# Altium schematic sheet mux-optical.SchDoc: MUX-OPTICAL
size A4; DrawnBy: Dylan Vogel; Organization: UTAT SS; DocumentNumber: 6; Revision: 1; SheetNumber: 6; SheetTotal: 7
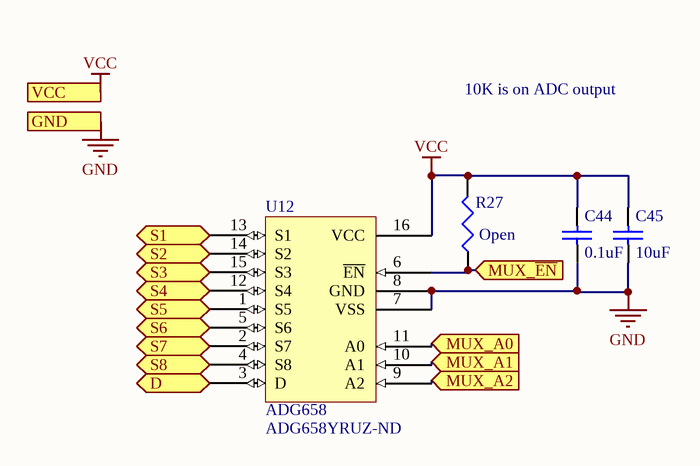
[diagram p0: mux-optical.SchDoc]

## Parts
C44  0.1uF  [0402]
C45  10uF  [1608[0603]]
R27  Open  [0402]
U12  ADG658  Supplier Part Number 1: ADG658YRUZ-ND  [SSOP16_N]

## Ports
D (bidir), GND, MUX_A0 (in), MUX_A1 (in), MUX_A2 (in), MUX_~{EN} (in), S1 (bidir), S2 (bidir), S3 (bidir), S4 (bidir), S5 (bidir), S6 (bidir), S7 (bidir), S8 (bidir), VCC

## Nets
GND: C44.1 C45.1 U12.7(VSS) U12.8(GND) ; port GND
VCC: C44.2 C45.2 R27.2 U12.16(VCC) ; port VCC
D: U12.3(D) ; port D
MUX_A0: U12.11(A0) ; port MUX_A0
MUX_A1: U12.10(A1) ; port MUX_A1
MUX_A2: U12.9(A2) ; port MUX_A2
MUX_~{EN}: R27.1 U12.6(~{EN}) ; port MUX_~{EN}
S1: U12.13(S1) ; port S1
S2: U12.14(S2) ; port S2
S3: U12.15(S3) ; port S3
S4: U12.12(S4) ; port S4
S5: U12.1(S5) ; port S5
S6: U12.5(S6) ; port S6
S7: U12.2(S7) ; port S7
S8: U12.4(S8) ; port S8

## Notes on the sheet
- 10K is on ADC output

## Library data of the parts
C44 C45 = Cap Semi: Capacitor (Semiconductor SIM Model); Published: 8-Jun-2000; LatestRevisionDate: 29-May-2009; LatestRevisionNote: IPC-7351 Footprint Added.; PackageReference: C1206; Publisher: Altium Limited; PackageDescription: Chip Capacitor; Supplier: Digi-Key
  C44: Value: 0.1uF
  C45: Value: 10uF
R27 = Res3: Resistor; Published: 8-Jun-2000; LatestRevisionDate: 29-May-2009; LatestRevisionNote: IPC-7351 Footprint Added.; PackageReference: J1-0603; Publisher: Altium Limited; PackageDescription: Chip Resistor; Value: Open; Supplier: Digi-Key
U12 = ADG658: Eight channel analog multiplexer.; Supplier 1: Digi-Key; Supplier: Digi-Key